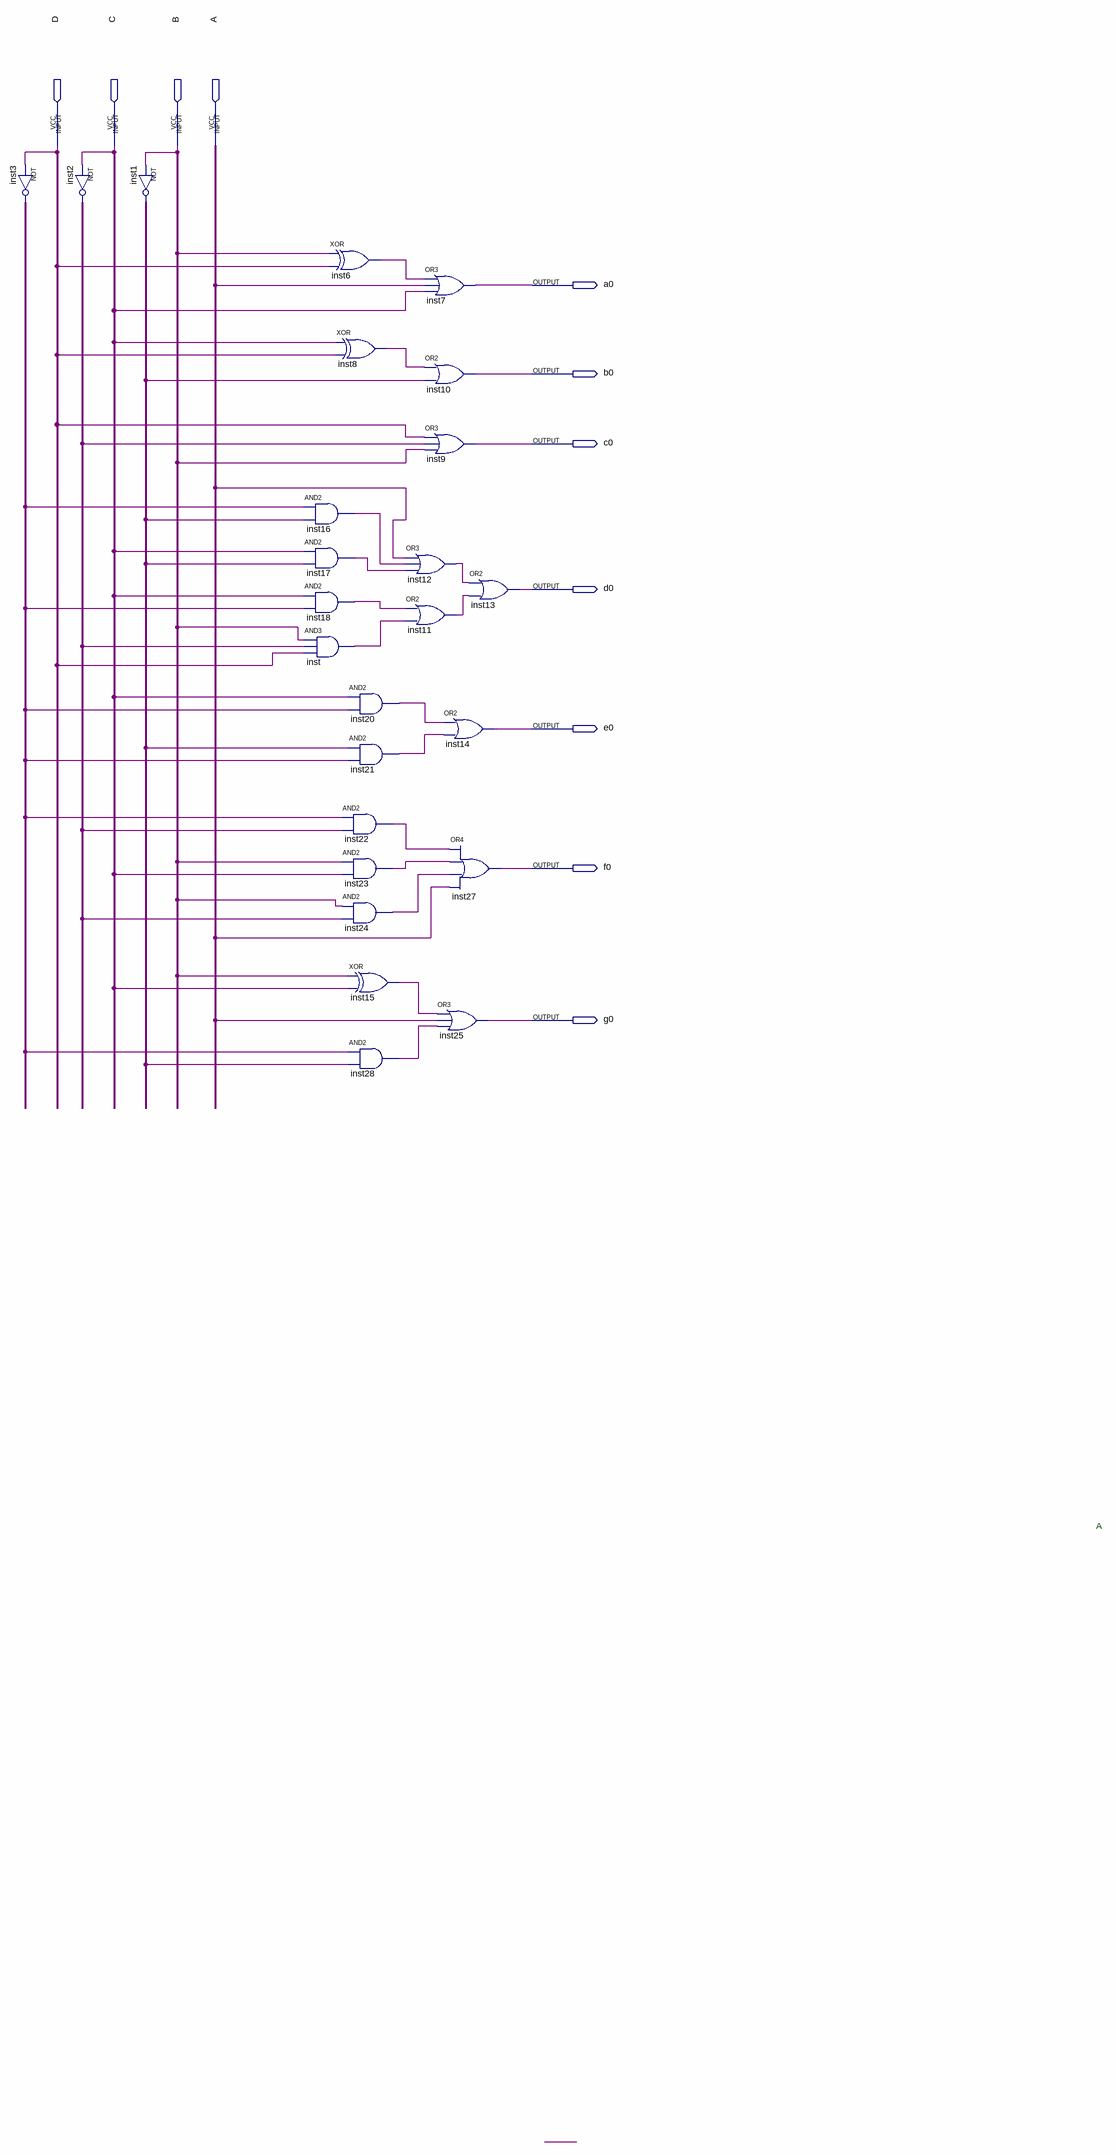
[diagram p0: schematic sheet]
// Quartus schematic Teste1_blocos.bdf as structural Verilog: 25 symbols, 11 pins
module Teste1_blocos (
  input  D,
  input  C,
  input  B,
  input  A,
  output a0,
  output b0,
  output c0,
  output d0,
  output e0,
  output f0,
  output g0
);

  wire inst1_out, inst2_out, inst3_out, inst6_out, inst8_out, inst11_out, inst12_out, inst15_out, inst16_out,
       inst17_out, inst18_out, inst20_out, inst21_out, inst22_out, inst23_out, inst24_out, inst28_out,
       inst_out, undriven, undriven_2, undriven_3;

  not inst3 (inst3_out, D);
  not inst2 (inst2_out, C);
  not inst1 (inst1_out, B);
  xor inst6 (inst6_out, undriven_2, undriven);
  and inst16 (inst16_out, inst3_out, inst1_out);
  and inst17 (inst17_out, undriven_3, inst1_out);
  and inst18 (inst18_out, undriven_3, inst3_out);
  and inst (inst_out, undriven_2, inst2_out, undriven);
  xor inst8 (inst8_out, undriven_3, undriven);
  and inst20 (inst20_out, undriven_3, inst3_out);
  and inst21 (inst21_out, inst1_out, inst3_out);
  and inst22 (inst22_out, inst3_out, inst2_out);
  and inst23 (inst23_out, undriven_2, undriven_3);
  and inst24 (inst24_out, undriven_2, inst2_out);
  xor inst15 (inst15_out, undriven_2, undriven_3);
  and inst28 (inst28_out, inst3_out, inst1_out);
  or inst7 (a0, inst6_out, A, undriven_3);
  or inst10 (b0, inst8_out, inst1_out);
  or inst9 (c0, undriven, inst2_out, undriven_2);
  or inst12 (inst12_out, A, inst16_out, inst17_out);
  or inst11 (inst11_out, inst18_out, inst_out);
  or inst13 (d0, inst12_out, inst11_out);
  or inst14 (e0, inst20_out, inst21_out);
  or inst27 (f0, inst22_out, inst23_out, inst24_out, A);
  or inst25 (g0, inst15_out, A, inst28_out);

  // Notes on the sheet:
  //   A
endmodule
